# EAGLE schematic gcp (EAGLE 9.6.2)
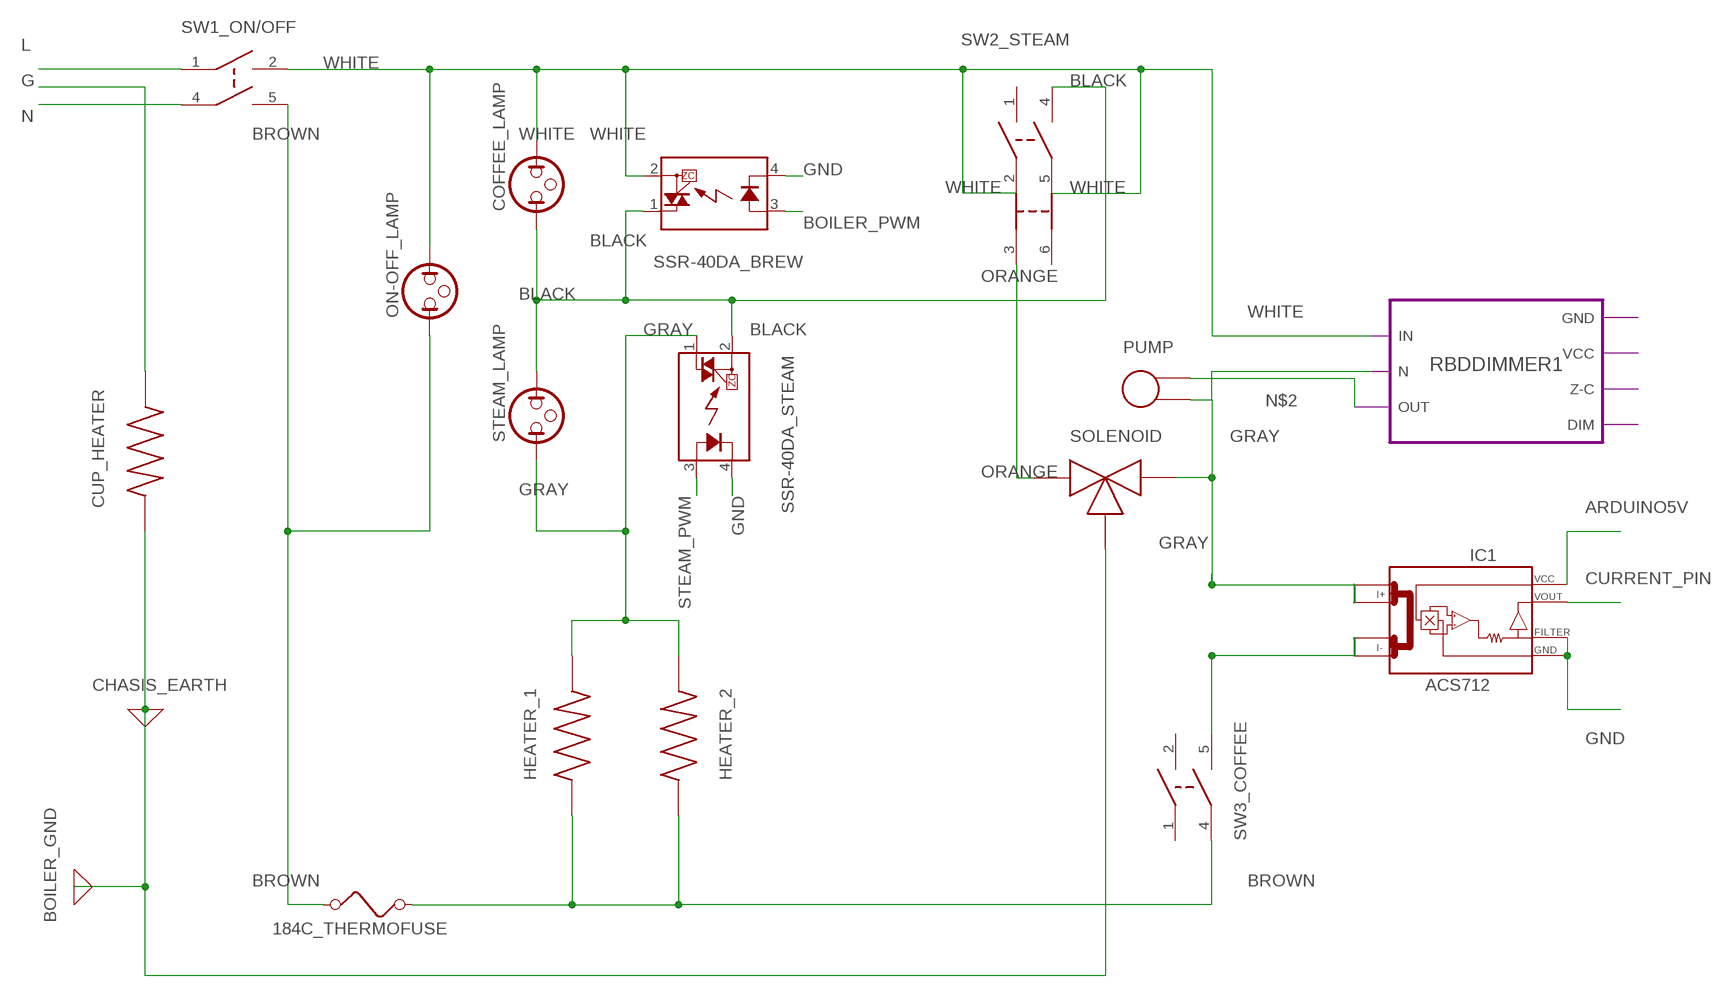
[diagram p0: schematic, sheet 1]

## Parts
184C_THERMOFUSE  FUSE  [FUSE]
COFFEE_LAMP  NEON  [LDH-3R]
CUP_HEATER  HEATER  [HEATER]
HEATER_1  HEATER  [HEATER]
HEATER_2  HEATER  [HEATER]
IC1  ACS712  [SO08]
NORMALLY_OPEN  SOLENOID  [SOLENOID]
ON-OFF_LAMP  NEON  [LDH-3R]
PUMP  PUMP  [PUMP]
SSR-40DA_BREW  S102S02  [S202S02]
SSR-40DA_STEAM  S102S02  [S202S02]
STEAM_LAMP  NEON  [LDH-3R]
SW1_ON/OFF  POWER/COFFEE_SWITCHON-OFF  [DPST]
SW2_STEAM  STEAM_SWITCHON-OFF  [DPST]
SW3_COFFEE  POWER/COFFEE_SWITCHON-OFF  [DPST]

## Module instances
RBDDIMMER1 = RBDDIMMER

## Nets
ARDUINO5V: IC1.8(VCC)
BLACK: COFFEE_LAMP.1 SSR-40DA_BREW.1(DS1) SSR-40DA_STEAM.2(DS2) STEAM_LAMP.2 SW2_STEAM.4
BOILER_PWM: SSR-40DA_BREW.3(A)
BROWN: 184C_THERMOFUSE.1 184C_THERMOFUSE.2 HEATER_1.P$1 HEATER_2.P$1 ON-OFF_LAMP.1 SW1_ON/OFF.5 SW3_COFFEE.4
CURRENT_PIN: IC1.7(VOUT)
EARTH: CUP_HEATER.P$2 NORMALLY_OPEN.P$3 ; supply symbol labelled GND
G: CUP_HEATER.P$1
GND: IC1.5(GND) IC1.6(FILTER) SSR-40DA_BREW.4(K) SSR-40DA_STEAM.4(K)
GRAY: HEATER_1.P$2 HEATER_2.P$2 IC1.1(I+_0) NORMALLY_OPEN.P$2 PUMP.P$1 SSR-40DA_STEAM.1(DS1) STEAM_LAMP.1
L: SW1_ON/OFF.1
N: SW1_ON/OFF.4
N$1: IC1.4(I-_1) SW3_COFFEE.5
N$2: PUMP.P$2 ; port RBDDIMMER1.OUT
ORANGE: NORMALLY_OPEN.P$1 SW2_STEAM.3
STEAM_PWM: SSR-40DA_STEAM.3(A)
WHITE: COFFEE_LAMP.2 ON-OFF_LAMP.2 SSR-40DA_BREW.2(DS2) SW1_ON/OFF.2 SW2_STEAM.2 SW2_STEAM.5
Unconnected: IC1.2(I+_1) IC1.3(I-_0) SW2_STEAM.1 SW2_STEAM.6 SW3_COFFEE.1 SW3_COFFEE.2

## Library data of the parts
184C_THERMOFUSE = special:FUSE: FUSE 5 x 20 mm
COFFEE_LAMP ON-OFF_LAMP STEAM_LAMP = special:NEON: Neon LAMP
CUP_HEATER HEATER_1 HEATER_2 = gcp:HEATER: HEATING ELEMENT
IC1 = ACS712:ACS712
NORMALLY_OPEN = gcp:SOLENOID: NORMALLY OPEN, THREE WAY SOLENOID VALVE
PUMP = gcp:PUMP: Vibratory Pump
SSR-40DA_BREW SSR-40DA_STEAM = relay:S*02S02: IT(rms) 8A, Zero Cross type SIP 4pin Triac output SSR Source: http://sharp-world.com/products/device/lineup/data/pdf/datasheet/s102s02_e.pdf; OC_FARNELL: unknown; OC_NEWARK: unknown
SW1_ON/OFF SW3_COFFEE = gcp:POWER/COFFEE_SWITCH: Gaggia Classic Pro Rocker Switches
SW2_STEAM = gcp:STEAM_SWITCH: Gaggia Classic Pro Rocker Switches

## Module RBDDIMMER
Ports: IN(io) N(io) OUT(io) GND(io) VCC(io) Z-C(io) DIM(io)

### Library data of the parts